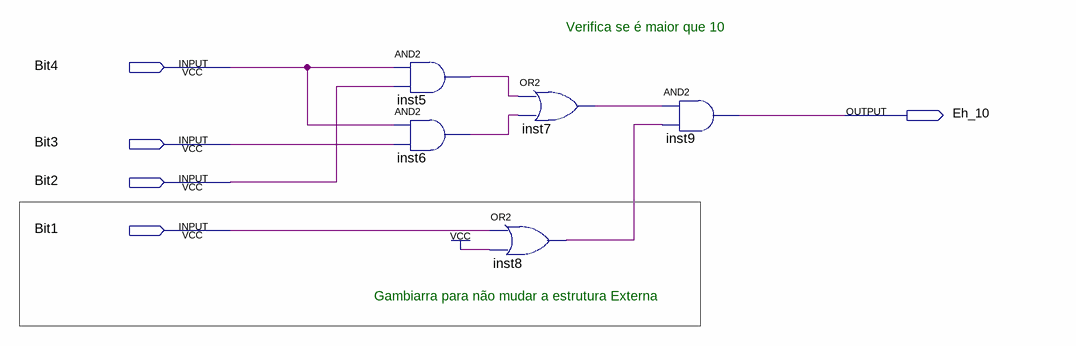
[diagram p0: schematic sheet]
// Quartus schematic Se10.bdf as structural Verilog: 5 symbols, 5 pins
module Se10 (
  input  Bit4,
  input  Bit3,
  input  Bit2,
  input  Bit1,
  output Eh_10
);

  wire inst5_out, inst6_out, inst7_out, inst8_out;

  and inst5 (inst5_out, Bit4, Bit2);
  and inst6 (inst6_out, Bit4, Bit3);
  or inst7 (inst7_out, inst5_out, inst6_out);
  or inst8 (inst8_out, Bit1, 1'b1);
  and inst9 (Eh_10, inst7_out, inst8_out);

  // Notes on the sheet:
  //   Verifica se é maior que 10
  //   Gambiarra para não mudar a estrutura Externa 
endmodule
